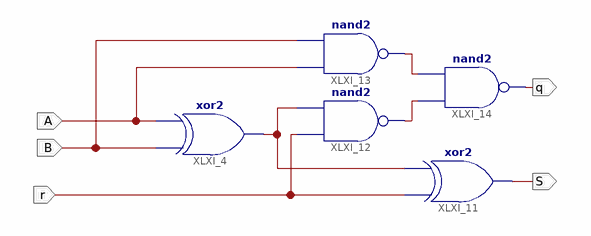
[diagram p0: schematic sheet 1]
// Xilinx ISE schematic gates - Copy.sch (spartan3e) as structural Verilog: 5 symbols, 5 ports
module \gates_-_Copy  (
  input  B,
  input  A,
  input  r,
  output q,
  output S
);

  wire XLXN_80, XLXN_81, XLXN_96;

  xor XLXI_4 (XLXN_96, B, A);
  xor XLXI_11 (S, r, XLXN_96);
  nand XLXI_12 (XLXN_80, r, XLXN_96);
  nand XLXI_13 (XLXN_81, A, B);
  nand XLXI_14 (q, XLXN_80, XLXN_81);
endmodule
